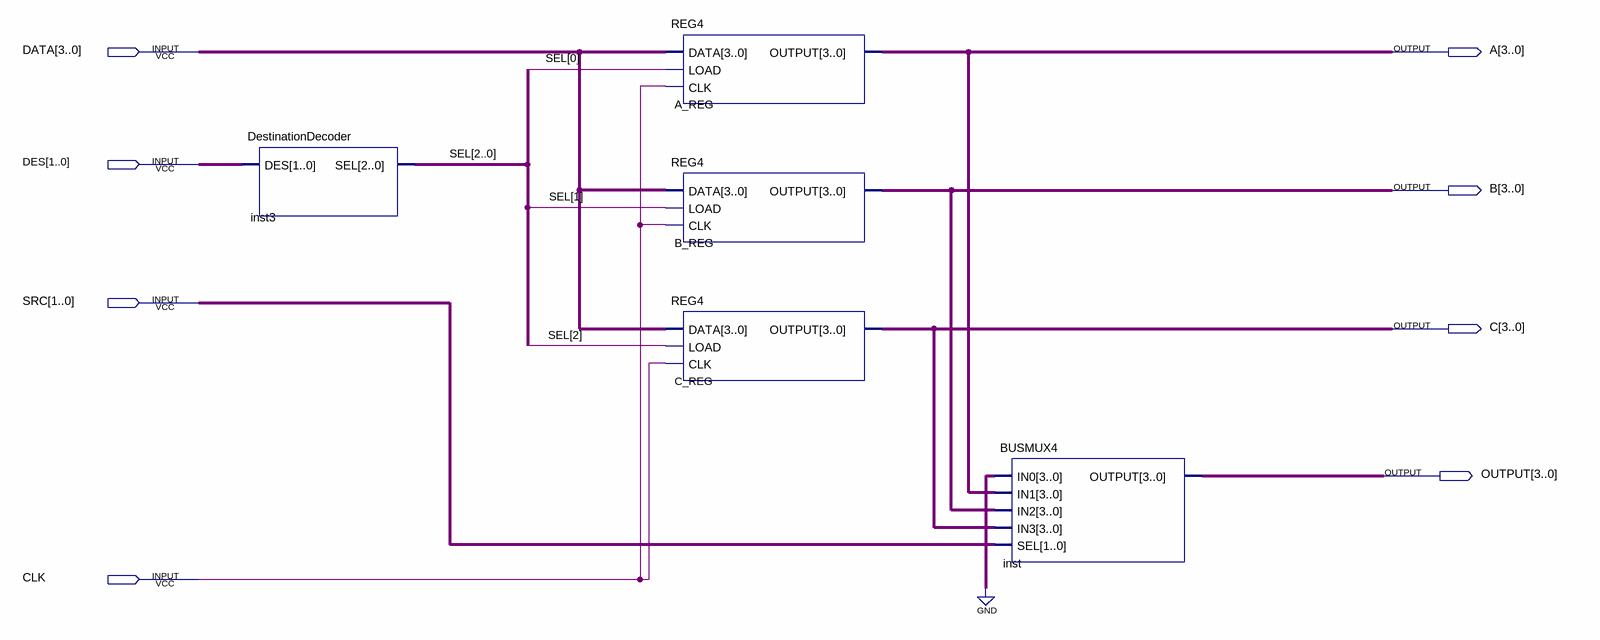
[diagram p0: schematic sheet]
// Quartus schematic RegisterFile.bdf as structural Verilog: 5 symbols, 8 pins
module RegisterFile (
  input  [3:0] DATA,
  input  [1:0] DES,
  input  [1:0] SRC,
  input  CLK,
  output [3:0] A,
  output [3:0] B,
  output [3:0] C,
  output [3:0] OUTPUT
);

  wire [2:0] SEL;

  DestinationDecoder inst3 (.DES(DES), .SEL(SEL));
  REG4 A_REG (.DATA(DATA), .LOAD(SEL[0]), .CLK(CLK), .OUTPUT(A));
  REG4 B_REG (.DATA(DATA), .LOAD(SEL[1]), .CLK(CLK), .OUTPUT(B));
  REG4 C_REG (.DATA(DATA), .LOAD(SEL[2]), .CLK(CLK), .OUTPUT(C));
  BUSMUX4 inst (.IN0(4'b0000), .IN1(A), .IN2(B), .IN3(C), .SEL(SRC), .OUTPUT(OUTPUT));
endmodule
